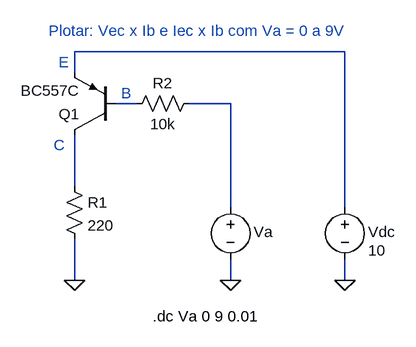
[diagram p0: schematic curva_pnp_BC557C.asc]
curva_pnp_BC557C.asc, the LTspice schematic file:
Version 4
SHEET 1 1032 680
WIRE 320 -160 -96 -160
WIRE -96 -128 -96 -160
WIRE 0 -80 -32 -80
WIRE 144 -80 80 -80
WIRE -96 48 -96 -32
WIRE 144 80 144 -80
WIRE 320 80 320 -160
WIRE -96 192 -96 128
WIRE 144 192 144 160
WIRE 320 192 320 160
FLAG 144 192 0
FLAG -96 192 0
FLAG 320 192 0
SYMBOL voltage 144 64 R0
WINDOW 0 36 54 Left 2
WINDOW 123 0 0 Left 2
WINDOW 39 36 82 Left 2
WINDOW 3 24 96 Invisible 2
SYMATTR InstName Va
SYMATTR Value 0
SYMBOL res -112 32 R0
SYMATTR InstName R1
SYMATTR Value 220
SYMBOL voltage 320 64 R0
WINDOW 0 36 54 Left 2
WINDOW 123 0 0 Left 2
WINDOW 39 36 82 Left 2
WINDOW 3 36 82 Left 2
SYMATTR InstName Vdc
SYMATTR Value 10
SYMBOL res -16 -64 R270
WINDOW 0 32 56 VTop 2
WINDOW 3 0 56 VBottom 2
SYMATTR InstName R2
SYMATTR Value 10k
SYMBOL pnp -32 -32 R180
SYMATTR InstName Q1
SYMATTR Value BC557C
TEXT 24 248 Left 2 !.dc Va 0 9 0.01
TEXT -136 -192 Left 2 ;Plotar: Vec x Ib e Iec x Ib com Va = 0 a 9V
TEXT -128 -16 Left 2 ;C
TEXT -24 -96 Left 2 ;B
TEXT -120 -144 Left 2 ;E

The netlist it stands for:
* curva_pnp_BC557C.asc
Va N003 0 0
R1 N004 0 220
Vdc N001 0 10
R2 N002 N003 10k
Q1 N004 N002 N001 0 BC557C
.model NPN NPN
.model PNP PNP
.lib standard.bjt
.dc Va 0 9 0.01
* Plotar: Vec x Ib e Iec x Ib com Va = 0 a 9V
* C
* B
* E
.backanno
.end